# EAGLE design openevse-ac-filter-v1.0 (EAGLE 7.6.0)
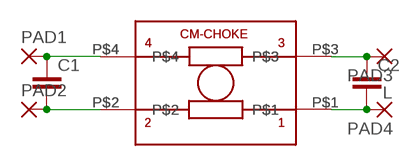
[diagram p0: schematic, sheet 1]

## Parts
C1  C5/2.5  [C5B2.5]
C2  C5/2.5  [C5B2.5]
PAD1  2,54/0,9  [2,54/0,9]
PAD2  2,54/0,9  [2,54/0,9]
PAD3  2,54/0,9  [2,54/0,9]
PAD4  L  2,54/0,9  [2,54/0,9]
U$1  47mH  RN114-0.3-02-47M  [RN114-0.3-02-47M]
U$2  RN214-0.3-02-47M  [RN214-0.3-02-47M]

## Nets
N$1: C1.1 PAD1.1(P) U$1.P$4 U$2.P$4
N$2: C1.2 PAD2.1(P) U$1.P$2 U$2.P$2
N$3: C2.1 PAD3.1(P) U$1.P$3 U$2.P$3
N$4: C2.2 PAD4.1(P) U$1.P$1 U$2.P$1

## Library data of the parts
C1 C2 = capacitor-wima:C: CAPACITOR naming: grid - package width
PAD1-PAD4 = wirepad:2,54/0,9: THROUGH-HOLE PAD
U$1 = Schaffner-CM-Choke:RN114-0.3-02-47M
U$2 = Schaffner-CM-Choke:RN214-0.3-02-47M

## Board
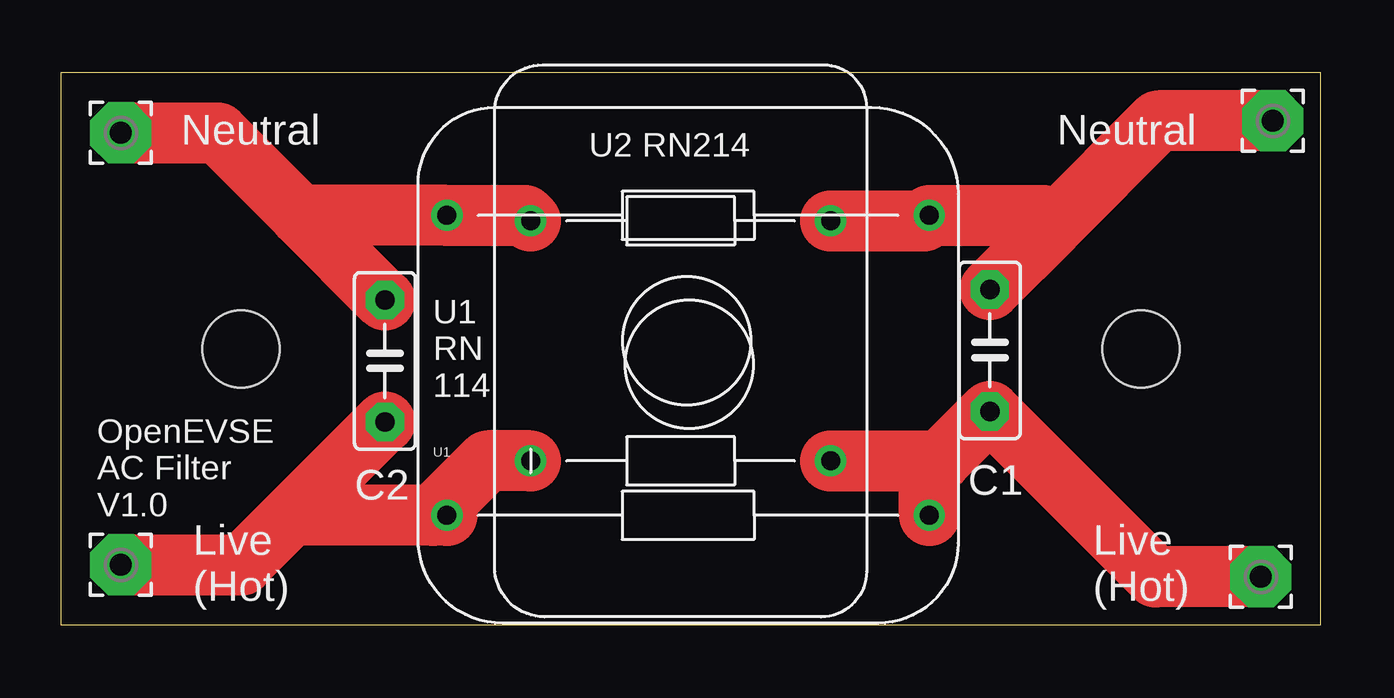
[diagram p1: board, top side]

Size 52.5 x 23 mm. Coordinates in mm from the lower left corner, seen from the top.
Outline: 0,0 52.5,0 52.5,23 0,23 0,0
Copper layers (1*16): Top 0.035mm / dielectric 1.5mm / Bottom 0.035mm
Design rules "default": minimum track width 10mil, minimum drill 24mil, track to track 8mil, track to pad 8mil, pad to pad 8mil, via to via 8mil, smd to smd 8mil, copper to edge 40mil, drill to drill 8mil, minimum pad ring 10mil, minimum via ring 8mil, stop-mask expansion 4mil, vias tented up to drill 0mil, thermal gap 10mil
Holes 3.2 mm at 7.5,11.5 45,11.5

### Footprints (pad centres in the part's own frame; a part is rotated, then mirrored left to right if it is on the bottom)
C5B2.5 = drill 0.813 pad 1.6 octagon: 1 -2.54,0; 2 2.54,0
2,54/0,9 = drill 0.914 pad 2.54 octagon: 1 0,0
RN114-0.3-02-47M = drill 0.8: P$1 9.87,-5.66; P$2 -10.23,-5.66; P$3 9.87,6.84; P$4 -10.23,6.84
RN214-0.3-02-47M = drill 0.8: P$1 14,6.5; P$2 1.5,6.5; P$3 14,16.5; P$4 1.5,16.5

### Placement (x,y rotation side)
C1  38.7,11.44 90 top
C2  13.5,11 90 top
PAD1  50,2 0 top
PAD2  50.5,21 0 top
PAD3  2.5,2.5 0 top
PAD4  2.5,20.5 0 top
U$1  25.95,11.41 180 top
U$2  33.57,23.34 180 top

### Tracks (layer width: path | path; a pad name or v marks a point on that pad's centre or on a via)
N$1
  Top 2.54: U$2.P$4 36,6.84 | 36,6.84 36.64,6.84 C1.1 45.6,2 PAD1.1 | U$1.P$4 36.18,6.66 36,6.84
N$2
  Top 2.54: U$2.P$2 35.95,16.84 U$1.P$2 40.93,17.07 41.36,16.64 | PAD2.1 45.72,21 41.36,16.64 | 41.36,16.64 C1.2
N$3
  Top 2.54: PAD3.1 7.54,2.5 9.77,4.73 | 9.77,4.73 C2.1 | U$1.P$3 15.5,4.57 | 15.5,4.57 9.93,4.57 9.77,4.73 | U$2.P$3 17.77,6.84 15.5,4.57
N$4
  Top 2.54: PAD4.1 6.54,20.5 9.97,17.07 | 9.97,17.07 C2.2 | 9.97,17.07 U$1.P$1 19.34,17.07 U$2.P$1

### Text on the board
tPlace: Neutral | Neutral | OpenEVSE / AC Filter / V1.0 | Live / (Hot) | Live / (Hot)
tNames: U2 RN214 | U1 / RN / 114 | U1